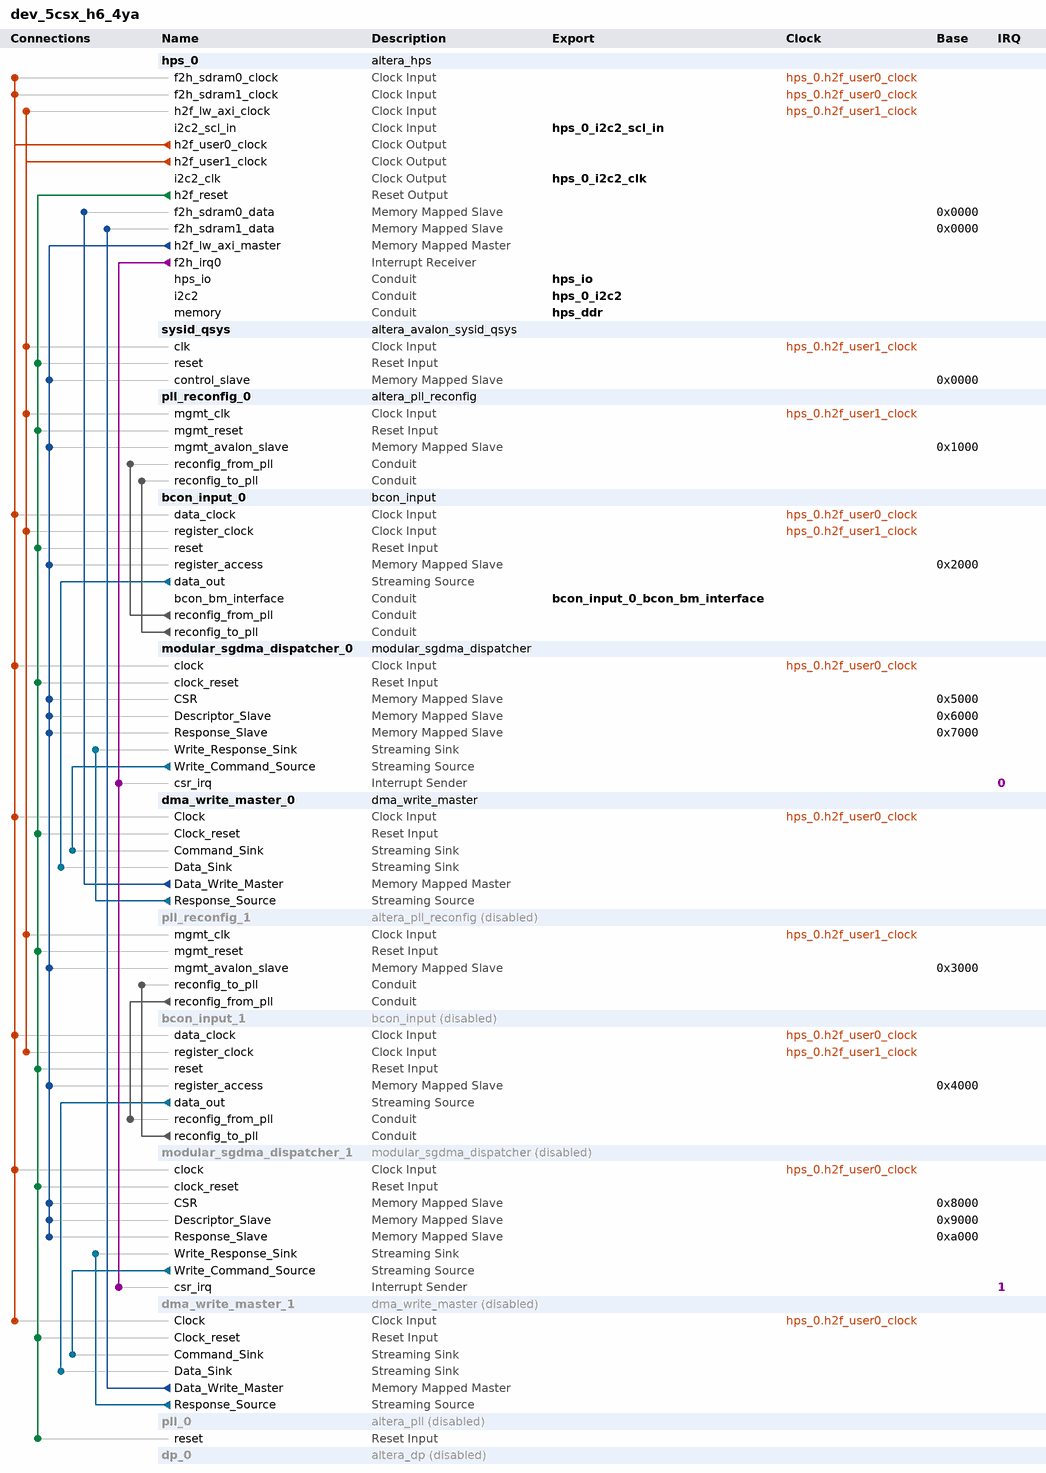
[diagram p0: system contents]
# Platform Designer (Qsys) system dev_5csx_h6_4ya, Cyclone V 5CSXFC6C6U23C7
# Parameters at their usual value, and those the tool derives, are not listed.
package require -exact qsys 16.1
create_system dev_5csx_h6_4ya
set_project_property DEVICE_FAMILY {Cyclone V}
set_project_property DEVICE 5CSXFC6C6U23C7

add_instance hps_0 altera_hps 16.1
set_instance_parameter_value hps_0 CAN0_Mode CAN
set_instance_parameter_value hps_0 CAN0_PinMuxing {HPS I/O Set 0}
set_instance_parameter_value hps_0 CAN1_Mode CAN
set_instance_parameter_value hps_0 CAN1_PinMuxing {HPS I/O Set 1}
set_instance_parameter_value hps_0 EMAC1_Mode RGMII
set_instance_parameter_value hps_0 EMAC1_PinMuxing {HPS I/O Set 0}
set_instance_parameter_value hps_0 F2SCLK_COLDRST_Enable false
set_instance_parameter_value hps_0 F2SCLK_DBGRST_Enable false
set_instance_parameter_value hps_0 F2SCLK_WARMRST_Enable false
set_instance_parameter_value hps_0 F2SDRAM_Type {Avalon-MM Write-Only,Avalon-MM Write-Only}
set_instance_parameter_value hps_0 F2SDRAM_Width 32,32
set_instance_parameter_value hps_0 F2SINTERRUPT_Enable true
set_instance_parameter_value hps_0 F2S_Width 0
set_instance_parameter_value hps_0 FPGA_PERIPHERAL_OUTPUT_CLOCK_FREQ_EMAC0_GTX_CLK 100
set_instance_parameter_value hps_0 FPGA_PERIPHERAL_OUTPUT_CLOCK_FREQ_EMAC0_MD_CLK 100.0
set_instance_parameter_value hps_0 FPGA_PERIPHERAL_OUTPUT_CLOCK_FREQ_EMAC1_GTX_CLK 100
set_instance_parameter_value hps_0 FPGA_PERIPHERAL_OUTPUT_CLOCK_FREQ_EMAC1_MD_CLK 100.0
set_instance_parameter_value hps_0 HPS_PROTOCOL DDR3
set_instance_parameter_value hps_0 I2C0_Mode I2C
set_instance_parameter_value hps_0 I2C0_PinMuxing {HPS I/O Set 1}
set_instance_parameter_value hps_0 I2C1_Mode I2C
set_instance_parameter_value hps_0 I2C1_PinMuxing {HPS I/O Set 0}
set_instance_parameter_value hps_0 I2C2_Mode Full
set_instance_parameter_value hps_0 I2C2_PinMuxing FPGA
set_instance_parameter_value hps_0 LWH2F_Enable true
set_instance_parameter_value hps_0 MEM_BANKADDR_WIDTH 3
set_instance_parameter_value hps_0 MEM_CLK_FREQ 400.0
set_instance_parameter_value hps_0 MEM_COL_ADDR_WIDTH 10
set_instance_parameter_value hps_0 MEM_DQ_WIDTH 40
set_instance_parameter_value hps_0 MEM_DRV_STR RZQ/7
set_instance_parameter_value hps_0 MEM_ROW_ADDR_WIDTH 15
set_instance_parameter_value hps_0 MEM_RTT_NOM RZQ/4
set_instance_parameter_value hps_0 MEM_RTT_WR {Dynamic ODT off}
set_instance_parameter_value hps_0 MEM_TCL 7
set_instance_parameter_value hps_0 MEM_TFAW_NS 30.0
set_instance_parameter_value hps_0 MEM_TRAS_NS 35.0
set_instance_parameter_value hps_0 MEM_TRCD_NS 13.75
set_instance_parameter_value hps_0 MEM_TRFC_NS 260.0
set_instance_parameter_value hps_0 MEM_TRP_NS 13.75
set_instance_parameter_value hps_0 MEM_TRRD_NS 10.0
set_instance_parameter_value hps_0 MEM_TRTP_NS 10.0
set_instance_parameter_value hps_0 MEM_VENDOR JEDEC
set_instance_parameter_value hps_0 MEM_VOLTAGE {1.35V DDR3L}
set_instance_parameter_value hps_0 MEM_WTCL 6
set_instance_parameter_value hps_0 QSPI_Mode {2 SS}
set_instance_parameter_value hps_0 QSPI_PinMuxing {HPS I/O Set 1}
set_instance_parameter_value hps_0 REF_CLK_FREQ 25.0
set_instance_parameter_value hps_0 S2FCLK_USER0CLK_Enable true
set_instance_parameter_value hps_0 S2FCLK_USER1CLK_Enable true
set_instance_parameter_value hps_0 S2FCLK_USER1CLK_FREQ 50.0
set_instance_parameter_value hps_0 S2FCLK_USER2CLK 5
set_instance_parameter_value hps_0 S2F_Width 0
set_instance_parameter_value hps_0 SDIO_Mode {4-bit Data}
set_instance_parameter_value hps_0 SDIO_PinMuxing {HPS I/O Set 0}
set_instance_parameter_value hps_0 SPIM1_Mode N/A
set_instance_parameter_value hps_0 SPIM1_PinMuxing Unused
set_instance_parameter_value hps_0 STM_Enable false
set_instance_parameter_value hps_0 TIMING_BOARD_AC_SKEW 0.0
set_instance_parameter_value hps_0 TIMING_BOARD_AC_TO_CK_SKEW 0.0
set_instance_parameter_value hps_0 TIMING_BOARD_DQ_TO_DQS_SKEW 0.0
set_instance_parameter_value hps_0 TIMING_BOARD_MAX_CK_DELAY 0.6
set_instance_parameter_value hps_0 TIMING_BOARD_MAX_DQS_DELAY 0.2
set_instance_parameter_value hps_0 TIMING_BOARD_SKEW_BETWEEN_DQS 0.01
set_instance_parameter_value hps_0 TIMING_BOARD_SKEW_CKDQS_DIMM_MAX 0.215
set_instance_parameter_value hps_0 TIMING_BOARD_SKEW_CKDQS_DIMM_MIN 0.092
set_instance_parameter_value hps_0 TIMING_BOARD_SKEW_WITHIN_DQS 0.0
set_instance_parameter_value hps_0 TIMING_TDH 45
set_instance_parameter_value hps_0 TIMING_TDQSCK 225
set_instance_parameter_value hps_0 TIMING_TDQSQ 100
set_instance_parameter_value hps_0 TIMING_TDQSS 0.27
set_instance_parameter_value hps_0 TIMING_TDS 10
set_instance_parameter_value hps_0 TIMING_TDSH 0.18
set_instance_parameter_value hps_0 TIMING_TDSS 0.18
set_instance_parameter_value hps_0 TIMING_TIH 120
set_instance_parameter_value hps_0 TIMING_TIS 170
set_instance_parameter_value hps_0 TIMING_TQSH 0.4
set_instance_parameter_value hps_0 UART0_Mode {No Flow Control}
set_instance_parameter_value hps_0 UART0_PinMuxing {HPS I/O Set 2}
set_instance_parameter_value hps_0 USB1_Mode SDR
set_instance_parameter_value hps_0 USB1_PinMuxing {HPS I/O Set 0}
set_instance_parameter_value hps_0 desired_cfg_clk_mhz 100.0
set_instance_parameter_value hps_0 desired_qspi_clk_mhz 400.0

add_instance sysid_qsys altera_avalon_sysid_qsys 16.1
set_instance_parameter_value sysid_qsys id 1

add_instance pll_reconfig_0 altera_pll_reconfig 16.1

add_instance bcon_input_0 bcon_input 1.0
set_instance_parameter_value bcon_input_0 g_lane_invert 30

add_instance modular_sgdma_dispatcher_0 modular_sgdma_dispatcher 16.1
set_instance_parameter_value modular_sgdma_dispatcher_0 BURST_ENABLE 0
set_instance_parameter_value modular_sgdma_dispatcher_0 BURST_WRAPPING_SUPPORT 0
set_instance_parameter_value modular_sgdma_dispatcher_0 CSR_ADDRESS_WIDTH 3
set_instance_parameter_value modular_sgdma_dispatcher_0 DATA_FIFO_DEPTH 32
set_instance_parameter_value modular_sgdma_dispatcher_0 DATA_WIDTH 32
set_instance_parameter_value modular_sgdma_dispatcher_0 DESCRIPTOR_FIFO_DEPTH 32
set_instance_parameter_value modular_sgdma_dispatcher_0 ENHANCED_FEATURES 1
set_instance_parameter_value modular_sgdma_dispatcher_0 GUI_RESPONSE_PORT 0
set_instance_parameter_value modular_sgdma_dispatcher_0 MAX_BURST_COUNT 2
set_instance_parameter_value modular_sgdma_dispatcher_0 MAX_BYTE 1024
set_instance_parameter_value modular_sgdma_dispatcher_0 MAX_STRIDE 1
set_instance_parameter_value modular_sgdma_dispatcher_0 MODE 2
set_instance_parameter_value modular_sgdma_dispatcher_0 PREFETCHER_USE_CASE 0
set_instance_parameter_value modular_sgdma_dispatcher_0 PROGRAMMABLE_BURST_ENABLE 0
set_instance_parameter_value modular_sgdma_dispatcher_0 STRIDE_ENABLE 0
set_instance_parameter_value modular_sgdma_dispatcher_0 TRANSFER_TYPE {Aligned Accesses}

add_instance dma_write_master_0 dma_write_master 16.1
set_instance_parameter_value dma_write_master_0 BURST_ENABLE 1
set_instance_parameter_value dma_write_master_0 DATA_WIDTH 32
set_instance_parameter_value dma_write_master_0 ERROR_ENABLE 0
set_instance_parameter_value dma_write_master_0 ERROR_WIDTH 8
set_instance_parameter_value dma_write_master_0 FIFO_DEPTH 1024
set_instance_parameter_value dma_write_master_0 FIFO_SPEED_OPTIMIZATION 1
set_instance_parameter_value dma_write_master_0 FIX_ADDRESS_WIDTH 32
set_instance_parameter_value dma_write_master_0 GUI_BURST_WRAPPING_SUPPORT 0
set_instance_parameter_value dma_write_master_0 GUI_MAX_BURST_COUNT 128
set_instance_parameter_value dma_write_master_0 GUI_PROGRAMMABLE_BURST_ENABLE 0
set_instance_parameter_value dma_write_master_0 GUI_STRIDE_WIDTH 1
set_instance_parameter_value dma_write_master_0 LENGTH_WIDTH 32
set_instance_parameter_value dma_write_master_0 PACKET_ENABLE 1
set_instance_parameter_value dma_write_master_0 STRIDE_ENABLE 0
set_instance_parameter_value dma_write_master_0 TRANSFER_TYPE {Aligned Accesses}
set_instance_parameter_value dma_write_master_0 USE_FIX_ADDRESS_WIDTH 0

add_instance pll_reconfig_1 altera_pll_reconfig 16.1
set_instance_property pll_reconfig_1 ENABLED false

add_instance bcon_input_1 bcon_input 1.0
set_instance_property bcon_input_1 ENABLED false
set_instance_parameter_value bcon_input_1 g_lane_invert 0

add_instance modular_sgdma_dispatcher_1 modular_sgdma_dispatcher 16.1
set_instance_property modular_sgdma_dispatcher_1 ENABLED false
set_instance_parameter_value modular_sgdma_dispatcher_1 BURST_ENABLE 0
set_instance_parameter_value modular_sgdma_dispatcher_1 BURST_WRAPPING_SUPPORT 0
set_instance_parameter_value modular_sgdma_dispatcher_1 CSR_ADDRESS_WIDTH 3
set_instance_parameter_value modular_sgdma_dispatcher_1 DATA_FIFO_DEPTH 32
set_instance_parameter_value modular_sgdma_dispatcher_1 DATA_WIDTH 32
set_instance_parameter_value modular_sgdma_dispatcher_1 DESCRIPTOR_FIFO_DEPTH 32
set_instance_parameter_value modular_sgdma_dispatcher_1 ENHANCED_FEATURES 1
set_instance_parameter_value modular_sgdma_dispatcher_1 GUI_RESPONSE_PORT 0
set_instance_parameter_value modular_sgdma_dispatcher_1 MAX_BURST_COUNT 2
set_instance_parameter_value modular_sgdma_dispatcher_1 MAX_BYTE 1024
set_instance_parameter_value modular_sgdma_dispatcher_1 MAX_STRIDE 1
set_instance_parameter_value modular_sgdma_dispatcher_1 MODE 2
set_instance_parameter_value modular_sgdma_dispatcher_1 PREFETCHER_USE_CASE 0
set_instance_parameter_value modular_sgdma_dispatcher_1 PROGRAMMABLE_BURST_ENABLE 0
set_instance_parameter_value modular_sgdma_dispatcher_1 STRIDE_ENABLE 0
set_instance_parameter_value modular_sgdma_dispatcher_1 TRANSFER_TYPE {Aligned Accesses}

add_instance dma_write_master_1 dma_write_master 16.1
set_instance_property dma_write_master_1 ENABLED false
set_instance_parameter_value dma_write_master_1 BURST_ENABLE 1
set_instance_parameter_value dma_write_master_1 DATA_WIDTH 32
set_instance_parameter_value dma_write_master_1 ERROR_ENABLE 0
set_instance_parameter_value dma_write_master_1 ERROR_WIDTH 8
set_instance_parameter_value dma_write_master_1 FIFO_DEPTH 1024
set_instance_parameter_value dma_write_master_1 FIFO_SPEED_OPTIMIZATION 1
set_instance_parameter_value dma_write_master_1 FIX_ADDRESS_WIDTH 32
set_instance_parameter_value dma_write_master_1 GUI_BURST_WRAPPING_SUPPORT 0
set_instance_parameter_value dma_write_master_1 GUI_MAX_BURST_COUNT 128
set_instance_parameter_value dma_write_master_1 GUI_PROGRAMMABLE_BURST_ENABLE 0
set_instance_parameter_value dma_write_master_1 GUI_STRIDE_WIDTH 1
set_instance_parameter_value dma_write_master_1 LENGTH_WIDTH 32
set_instance_parameter_value dma_write_master_1 PACKET_ENABLE 1
set_instance_parameter_value dma_write_master_1 STRIDE_ENABLE 0
set_instance_parameter_value dma_write_master_1 TRANSFER_TYPE {Aligned Accesses}
set_instance_parameter_value dma_write_master_1 USE_FIX_ADDRESS_WIDTH 0

add_instance pll_0 altera_pll 16.1
set_instance_property pll_0 ENABLED false
set_instance_parameter_value pll_0 gui_device_speed_grade 2
set_instance_parameter_value pll_0 gui_number_of_clocks 1
set_instance_parameter_value pll_0 gui_operation_mode direct
set_instance_parameter_value pll_0 gui_output_clock_frequency0 135.0
set_instance_parameter_value pll_0 gui_pll_auto_reset On
set_instance_parameter_value pll_0 gui_pll_mode {Integer-N PLL}
set_instance_parameter_value pll_0 gui_reference_clock_frequency 125.0
set_instance_parameter_value pll_0 gui_use_locked true

add_instance dp_0 altera_dp 16.1
set_instance_property dp_0 ENABLED false
set_instance_parameter_value dp_0 BASE_DEVICE Unknown
set_instance_parameter_value dp_0 DEVICE 5CSXFC6C6U23C7
set_instance_parameter_value dp_0 ENABLE_ED_FILESET_SIM 0
set_instance_parameter_value dp_0 ENABLE_ED_FILESET_SYNTHESIS 1
set_instance_parameter_value dp_0 RX_AUDIO_CHANS 2
set_instance_parameter_value dp_0 RX_AUX_DEBUG 0
set_instance_parameter_value dp_0 RX_AUX_GPU 0
set_instance_parameter_value dp_0 RX_EXPORT_MSA 0
set_instance_parameter_value dp_0 RX_I2C_SCL_KHZ 100
set_instance_parameter_value dp_0 RX_IEEE_OUI 1
set_instance_parameter_value dp_0 RX_MAX_LANE_COUNT 4
set_instance_parameter_value dp_0 RX_MAX_LINK_RATE 10
set_instance_parameter_value dp_0 RX_MAX_NUM_OF_STREAMS 1
set_instance_parameter_value dp_0 RX_PIXELS_PER_CLOCK 1
set_instance_parameter_value dp_0 RX_SCRAMBLER_SEED 65535
set_instance_parameter_value dp_0 RX_SUPPORT_AUDIO 0
set_instance_parameter_value dp_0 RX_SUPPORT_AUTOMATED_TEST 0
set_instance_parameter_value dp_0 RX_SUPPORT_DP 0
set_instance_parameter_value dp_0 RX_SUPPORT_GTC 0
set_instance_parameter_value dp_0 RX_SUPPORT_I2CMASTER 0
set_instance_parameter_value dp_0 RX_SUPPORT_MST 0
set_instance_parameter_value dp_0 RX_SUPPORT_SS 0
set_instance_parameter_value dp_0 RX_SYMBOLS_PER_CLOCK 2
set_instance_parameter_value dp_0 RX_VIDEO_BPS 8
set_instance_parameter_value dp_0 SELECT_CUSTOM_DEVICE 0
set_instance_parameter_value dp_0 SELECT_ED_FILESET VERILOG
set_instance_parameter_value dp_0 SELECT_SUPPORTED_VARIANT 0
set_instance_parameter_value dp_0 SELECT_TARGETED_BOARD 0
set_instance_parameter_value dp_0 TX_AUDIO_CHANS 2
set_instance_parameter_value dp_0 TX_AUX_DEBUG 0
set_instance_parameter_value dp_0 TX_MAX_LANE_COUNT 4
set_instance_parameter_value dp_0 TX_MAX_LINK_RATE 10
set_instance_parameter_value dp_0 TX_MAX_NUM_OF_STREAMS 1
set_instance_parameter_value dp_0 TX_PIXELS_PER_CLOCK 1
set_instance_parameter_value dp_0 TX_SCRAMBLER_SEED 65535
set_instance_parameter_value dp_0 TX_SUPPORT_ANALOG_RECONFIG 0
set_instance_parameter_value dp_0 TX_SUPPORT_AUDIO 0
set_instance_parameter_value dp_0 TX_SUPPORT_AUTOMATED_TEST 0
set_instance_parameter_value dp_0 TX_SUPPORT_DP 1
set_instance_parameter_value dp_0 TX_SUPPORT_GTC 0
set_instance_parameter_value dp_0 TX_SUPPORT_MST 0
set_instance_parameter_value dp_0 TX_SUPPORT_SS 0
set_instance_parameter_value dp_0 TX_SYMBOLS_PER_CLOCK 2
set_instance_parameter_value dp_0 TX_VIDEO_BPS 8
set_instance_parameter_value dp_0 device_family {Cyclone V}

# connections
add_connection hps_0.h2f_user0_clock bcon_input_0.data_clock clock
add_connection hps_0.h2f_user0_clock bcon_input_1.data_clock clock
add_connection hps_0.h2f_user0_clock dma_write_master_0.Clock clock
add_connection hps_0.h2f_user0_clock dma_write_master_1.Clock clock
add_connection hps_0.h2f_user0_clock hps_0.f2h_sdram0_clock clock
add_connection hps_0.h2f_user0_clock hps_0.f2h_sdram1_clock clock
add_connection hps_0.h2f_user0_clock modular_sgdma_dispatcher_0.clock clock
add_connection hps_0.h2f_user0_clock modular_sgdma_dispatcher_1.clock clock
add_connection hps_0.h2f_user1_clock bcon_input_0.register_clock clock
add_connection hps_0.h2f_user1_clock bcon_input_1.register_clock clock
add_connection hps_0.h2f_user1_clock hps_0.h2f_lw_axi_clock clock
add_connection hps_0.h2f_user1_clock pll_reconfig_0.mgmt_clk clock
add_connection hps_0.h2f_user1_clock pll_reconfig_1.mgmt_clk clock
add_connection hps_0.h2f_user1_clock sysid_qsys.clk clock
add_connection hps_0.h2f_reset bcon_input_0.reset reset
add_connection hps_0.h2f_reset bcon_input_1.reset reset
add_connection hps_0.h2f_reset dma_write_master_0.Clock_reset reset
add_connection hps_0.h2f_reset dma_write_master_1.Clock_reset reset
add_connection hps_0.h2f_reset modular_sgdma_dispatcher_0.clock_reset reset
add_connection hps_0.h2f_reset modular_sgdma_dispatcher_1.clock_reset reset
add_connection hps_0.h2f_reset pll_0.reset reset
add_connection hps_0.h2f_reset pll_reconfig_0.mgmt_reset reset
add_connection hps_0.h2f_reset pll_reconfig_1.mgmt_reset reset
add_connection hps_0.h2f_reset sysid_qsys.reset reset
add_connection dma_write_master_0.Data_Write_Master hps_0.f2h_sdram0_data avalon
set_connection_parameter_value dma_write_master_0.Data_Write_Master/hps_0.f2h_sdram0_data baseAddress 0x0000
add_connection dma_write_master_1.Data_Write_Master hps_0.f2h_sdram1_data avalon
set_connection_parameter_value dma_write_master_1.Data_Write_Master/hps_0.f2h_sdram1_data baseAddress 0x0000
add_connection hps_0.h2f_lw_axi_master bcon_input_0.register_access avalon
set_connection_parameter_value hps_0.h2f_lw_axi_master/bcon_input_0.register_access baseAddress 0x2000
add_connection hps_0.h2f_lw_axi_master bcon_input_1.register_access avalon
set_connection_parameter_value hps_0.h2f_lw_axi_master/bcon_input_1.register_access baseAddress 0x4000
add_connection hps_0.h2f_lw_axi_master modular_sgdma_dispatcher_0.CSR avalon
set_connection_parameter_value hps_0.h2f_lw_axi_master/modular_sgdma_dispatcher_0.CSR baseAddress 0x5000
add_connection hps_0.h2f_lw_axi_master modular_sgdma_dispatcher_0.Descriptor_Slave avalon
set_connection_parameter_value hps_0.h2f_lw_axi_master/modular_sgdma_dispatcher_0.Descriptor_Slave baseAddress 0x6000
add_connection hps_0.h2f_lw_axi_master modular_sgdma_dispatcher_0.Response_Slave avalon
set_connection_parameter_value hps_0.h2f_lw_axi_master/modular_sgdma_dispatcher_0.Response_Slave baseAddress 0x7000
add_connection hps_0.h2f_lw_axi_master modular_sgdma_dispatcher_1.CSR avalon
set_connection_parameter_value hps_0.h2f_lw_axi_master/modular_sgdma_dispatcher_1.CSR baseAddress 0x8000
add_connection hps_0.h2f_lw_axi_master modular_sgdma_dispatcher_1.Descriptor_Slave avalon
set_connection_parameter_value hps_0.h2f_lw_axi_master/modular_sgdma_dispatcher_1.Descriptor_Slave baseAddress 0x9000
add_connection hps_0.h2f_lw_axi_master modular_sgdma_dispatcher_1.Response_Slave avalon
set_connection_parameter_value hps_0.h2f_lw_axi_master/modular_sgdma_dispatcher_1.Response_Slave baseAddress 0xa000
add_connection hps_0.h2f_lw_axi_master pll_reconfig_0.mgmt_avalon_slave avalon
set_connection_parameter_value hps_0.h2f_lw_axi_master/pll_reconfig_0.mgmt_avalon_slave baseAddress 0x1000
add_connection hps_0.h2f_lw_axi_master pll_reconfig_1.mgmt_avalon_slave avalon
set_connection_parameter_value hps_0.h2f_lw_axi_master/pll_reconfig_1.mgmt_avalon_slave baseAddress 0x3000
add_connection hps_0.h2f_lw_axi_master sysid_qsys.control_slave avalon
set_connection_parameter_value hps_0.h2f_lw_axi_master/sysid_qsys.control_slave baseAddress 0x0000
add_connection bcon_input_0.data_out dma_write_master_0.Data_Sink avalon_streaming
add_connection bcon_input_1.data_out dma_write_master_1.Data_Sink avalon_streaming
add_connection dma_write_master_0.Response_Source modular_sgdma_dispatcher_0.Write_Response_Sink avalon_streaming
add_connection dma_write_master_1.Response_Source modular_sgdma_dispatcher_1.Write_Response_Sink avalon_streaming
add_connection modular_sgdma_dispatcher_0.Write_Command_Source dma_write_master_0.Command_Sink avalon_streaming
add_connection modular_sgdma_dispatcher_1.Write_Command_Source dma_write_master_1.Command_Sink avalon_streaming
add_connection bcon_input_0.reconfig_from_pll pll_reconfig_0.reconfig_from_pll conduit
add_connection bcon_input_0.reconfig_to_pll pll_reconfig_0.reconfig_to_pll conduit
add_connection bcon_input_1.reconfig_to_pll pll_reconfig_1.reconfig_to_pll conduit
add_connection pll_reconfig_1.reconfig_from_pll bcon_input_1.reconfig_from_pll conduit
add_connection hps_0.f2h_irq0 modular_sgdma_dispatcher_0.csr_irq interrupt
set_connection_parameter_value hps_0.f2h_irq0/modular_sgdma_dispatcher_0.csr_irq irqNumber 0
add_connection hps_0.f2h_irq0 modular_sgdma_dispatcher_1.csr_irq interrupt
set_connection_parameter_value hps_0.f2h_irq0/modular_sgdma_dispatcher_1.csr_irq irqNumber 1

# exported interfaces
add_interface bcon_input_0_bcon_bm_interface conduit end
set_interface_property bcon_input_0_bcon_bm_interface EXPORT_OF bcon_input_0.bcon_bm_interface
add_interface hps_0_i2c2 conduit end
set_interface_property hps_0_i2c2 EXPORT_OF hps_0.i2c2
add_interface hps_0_i2c2_clk clock source
set_interface_property hps_0_i2c2_clk EXPORT_OF hps_0.i2c2_clk
add_interface hps_0_i2c2_scl_in clock sink
set_interface_property hps_0_i2c2_scl_in EXPORT_OF hps_0.i2c2_scl_in
add_interface hps_ddr conduit end
set_interface_property hps_ddr EXPORT_OF hps_0.memory
add_interface hps_io conduit end
set_interface_property hps_io EXPORT_OF hps_0.hps_io

set_interconnect_requirement {$system} qsys_mm.clockCrossingAdapter HANDSHAKE
set_interconnect_requirement {$system} qsys_mm.maxAdditionalLatency 4

save_system dev_5csx_h6_4ya.qsys
